# EAGLE design sensor circuit (EAGLE 8.4.0)
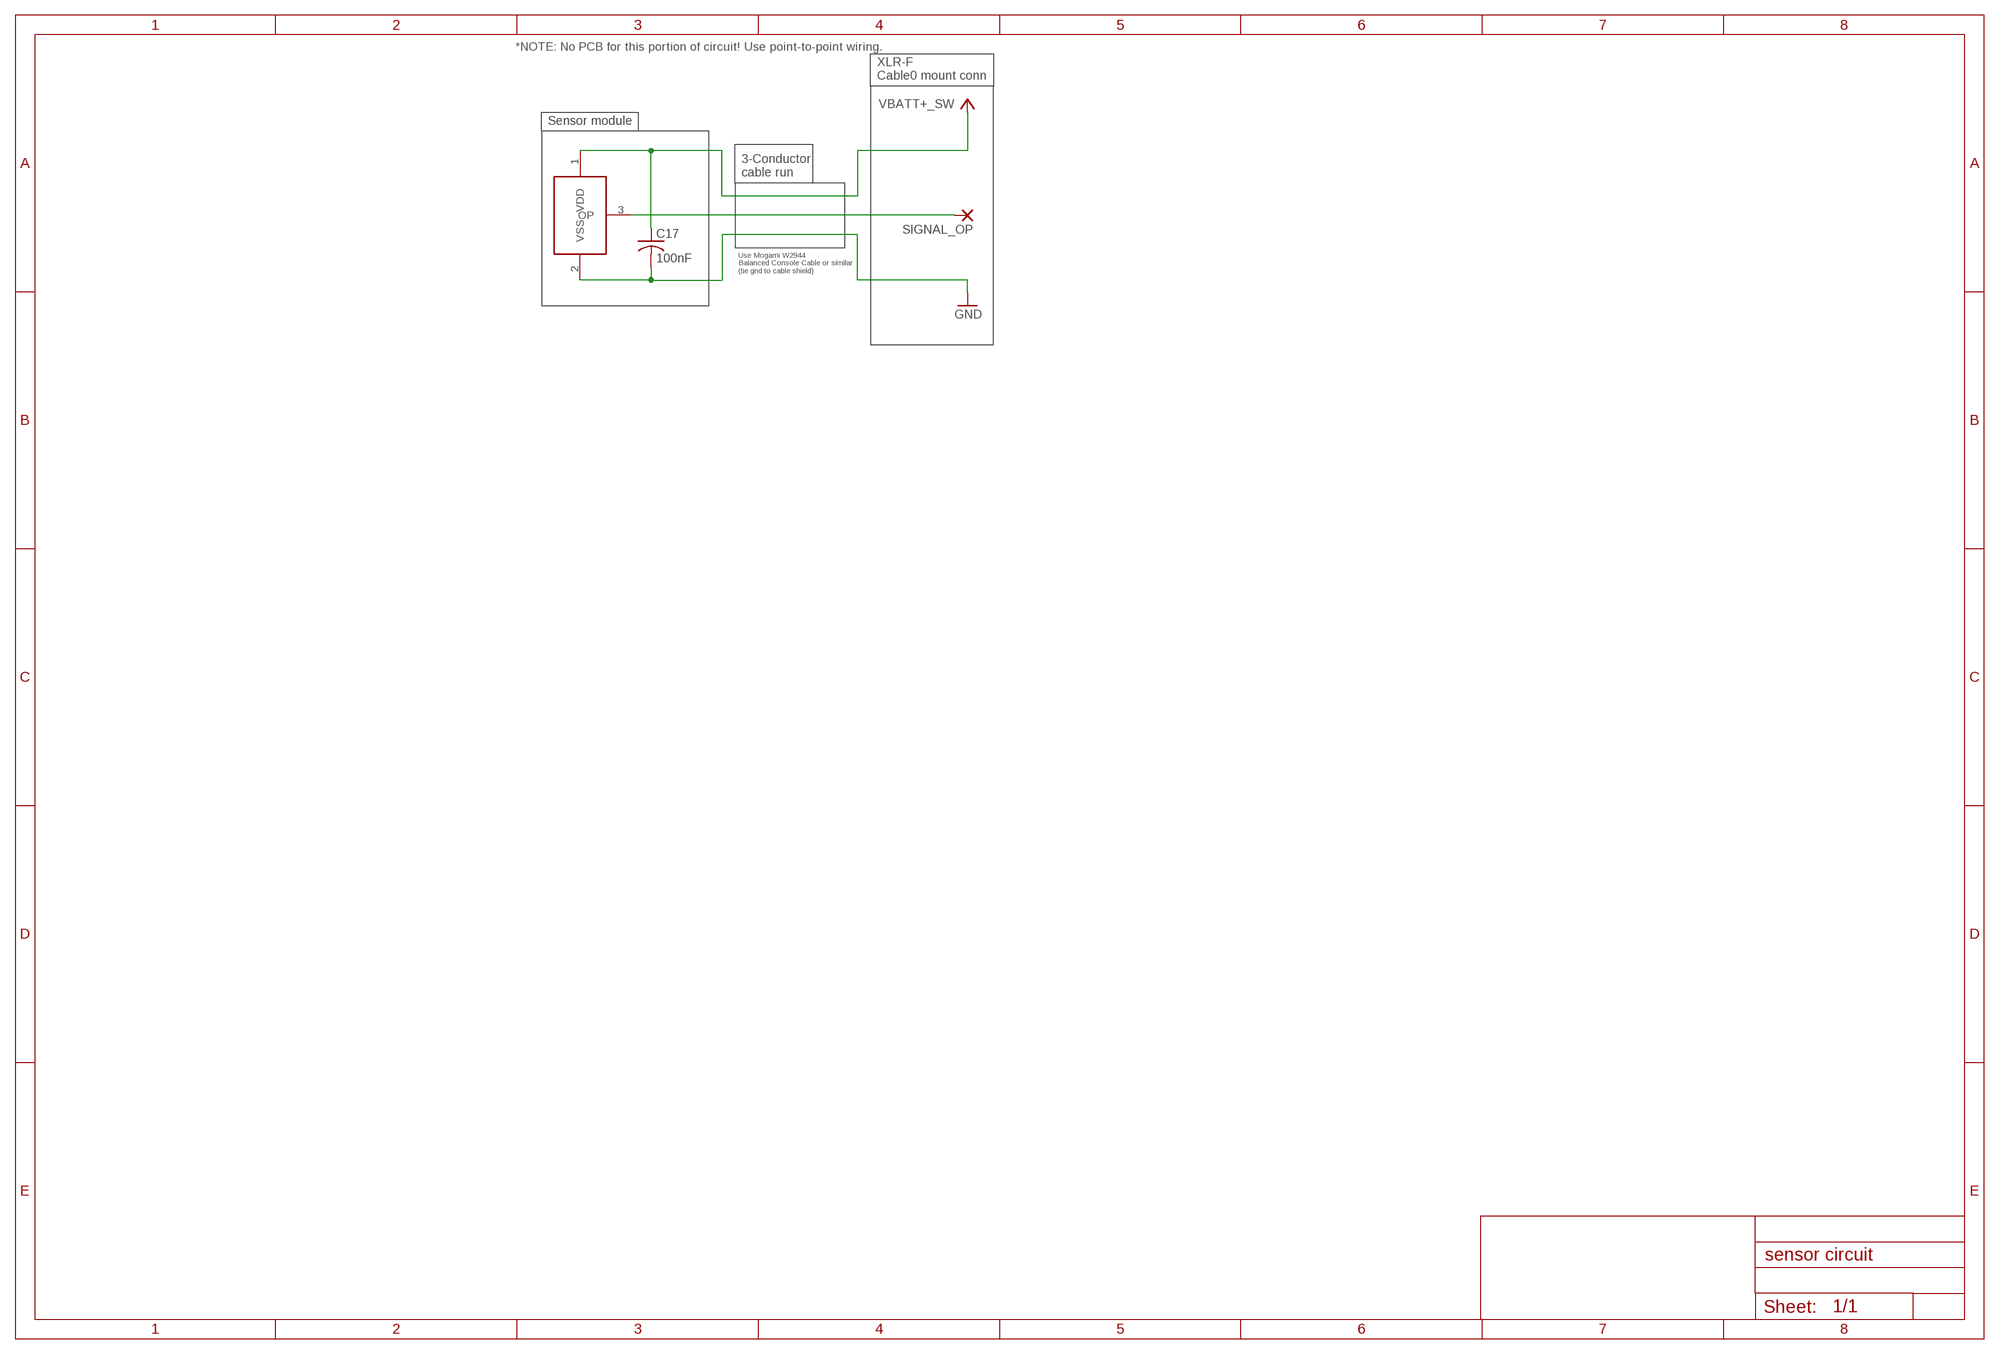
[diagram p0: schematic, sheet 1]

## Parts
C17  100nF  C-US025-024X044  [C025-024X044]
SIGNAL_OP  1,6/0,8  [1,6/0,8]
U1A  US5881  [TO-92]

## Nets
GND: C17.2 U1A.2(VSS)
N$37: SIGNAL_OP.1(P) U1A.3(OP)
VBATT+_SW: C17.1 U1A.1(VDD)

## Notes on the sheet
- *NOTE: No PCB for this portion of circuit! Use point-to-point wiring.
- XLR-F
  Cable0 mount conn
- Sensor module
- 3-Conductor
  cable run
- Use Mogami W2944
  Balanced Console Cable or similar
  (tie gnd to cable shield)

## Library data of the parts
C17 = rcl:C-US: CAPACITOR, American symbol
SIGNAL_OP = wirepad:1,6/0,8: THROUGH-HOLE PAD
U1A = US5881:US5881: Hall effect sensor in TO-92 package

## Board
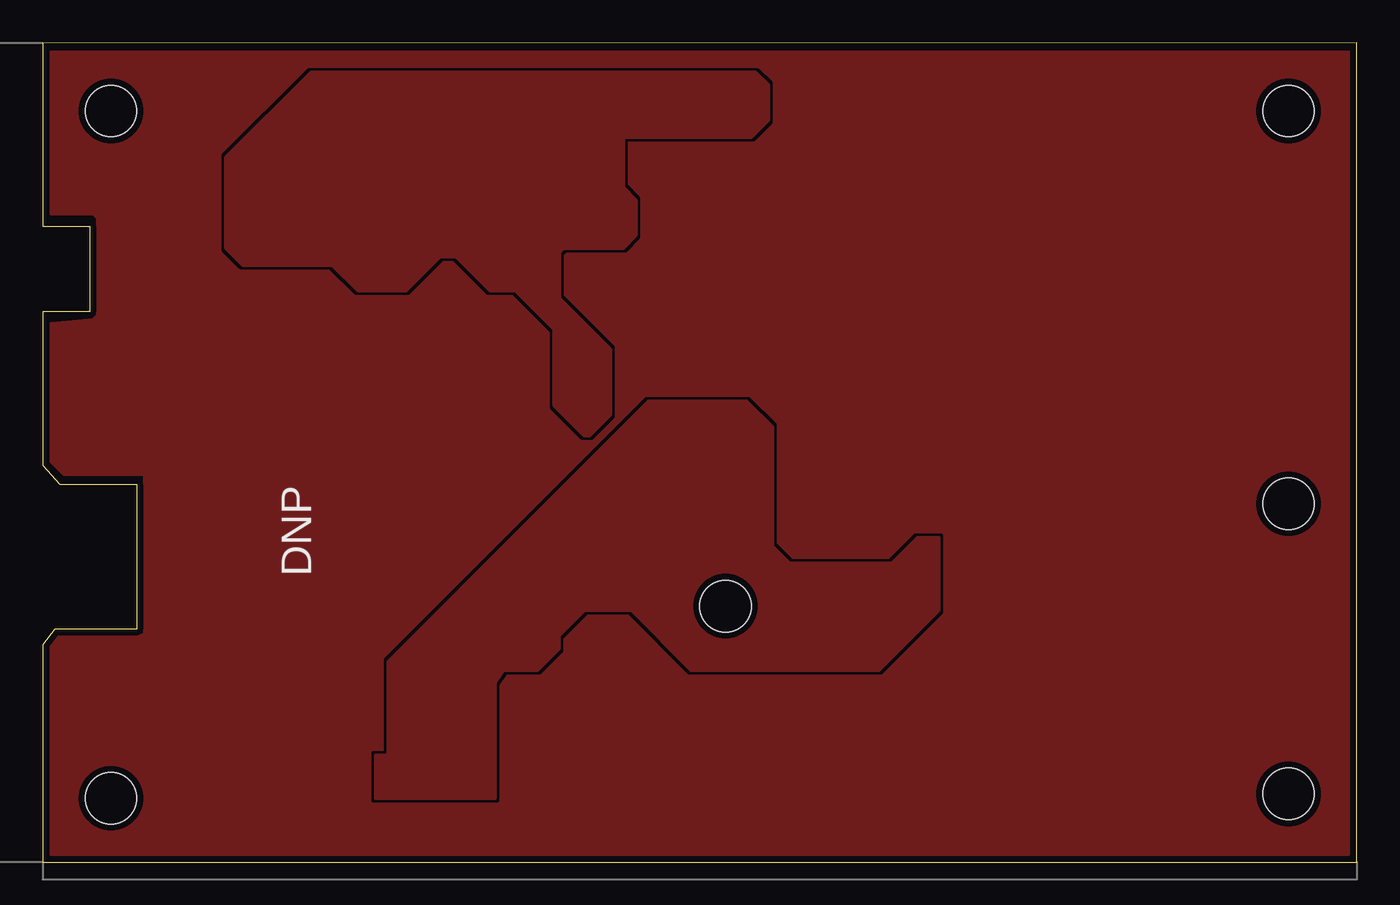
[diagram p1: board, top side]
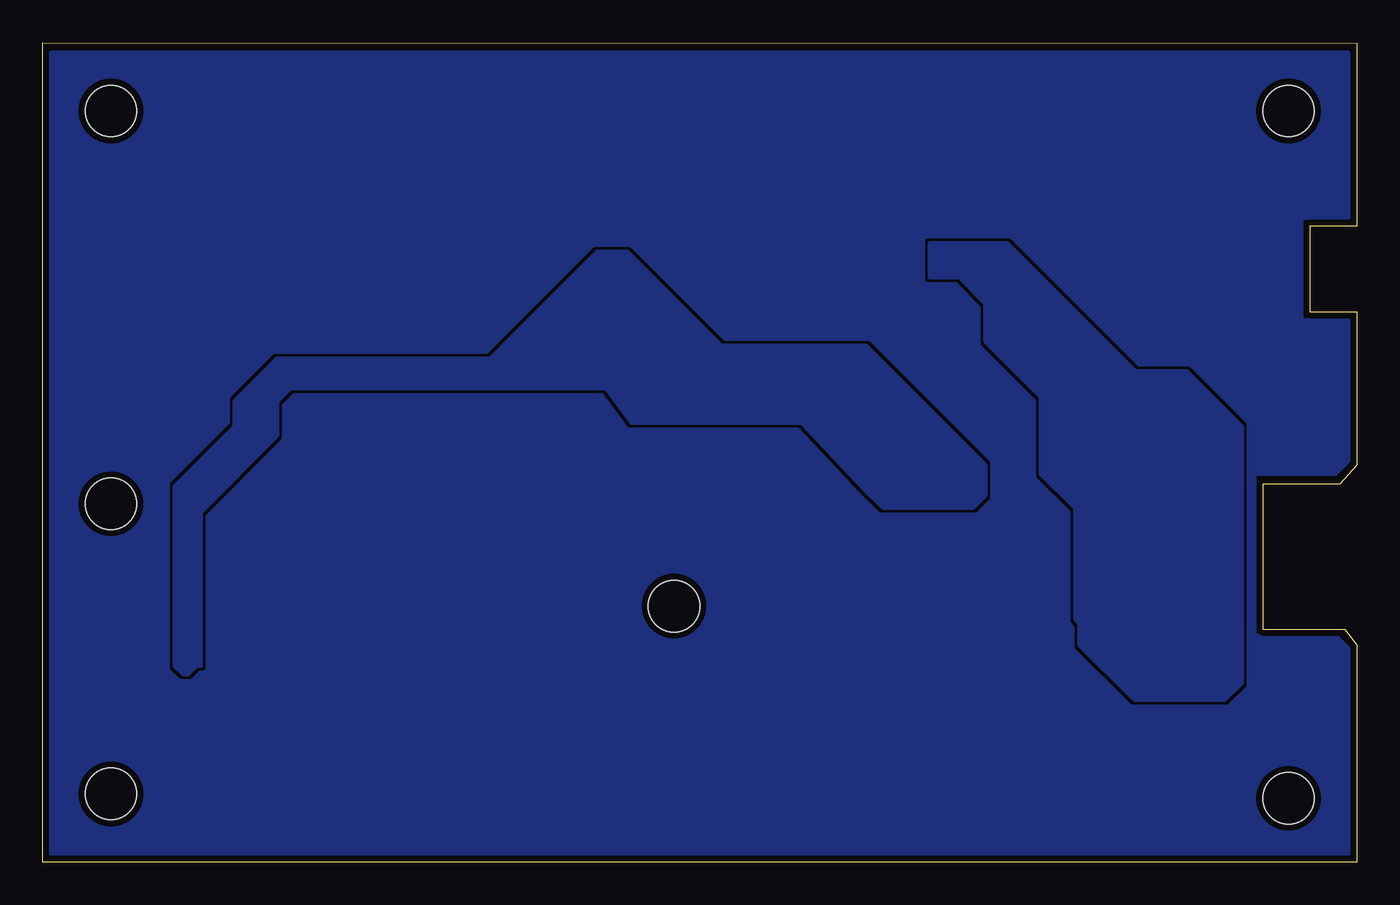
[diagram p2: board, bottom side, seen from below]

Size 77 x 48 mm. Coordinates in mm from the lower left corner, seen from the top.
Outline: 0,0 77,0 77,48 0,47.97 0,37.25 2.75,37.25 2.75,32.25 0,32.25 0,23.25 1,22.15 5.5,22.15 5.5,13.65 0.7,13.65 0,12.75 0,0
Copper layers (1*16): Top 0.0356mm / dielectric 1.5011mm / Bottom 0.0356mm
Design rules "LaenPCBOrder *": minimum track width 6mil, minimum drill 13mil, track to track 6mil, track to pad 6mil, pad to pad 6mil, via to via 6mil, smd to smd 6mil, copper to edge 15mil, drill to drill 6mil, minimum pad ring 7mil, minimum via ring 7mil, stop-mask expansion 3mil, vias tented up to drill 0mil, thermal gap 10mil
Holes 3 mm at 4,3.75 4,44 73,44 73,21 73,4 40,15

### Footprints (pad centres in the part's own frame; a part is rotated, then mirrored left to right if it is on the bottom)
C025-024X044 = drill 0.813 octagon: 1 -1.27,0; 2 1.27,0
1,6/0,8 = drill 0.813 pad 1.6 octagon: 1 0,0
TO-92 = drill 0.813 pad 1.88: 1 -1.27,0; 2 0,1.905; 3 1.27,0

### Placement (x,y rotation side)
C17  117.24,29.34 0 top  (outside the outline)
SIGNAL_OP  123.14,23.37 0 top  (outside the outline)
U1A  123.11,29.16 270 top  (outside the outline)

### Tracks (layer width: path | path; a pad name or v marks a point on that pad's centre or on a via)
+3V3
  pour Top: 35.5,27 20.25,11.75 20.25,6.25 19.5,6.25 19.5,3.75 26.5,3.75 26.5,10.5 27,11.25 29,11.25 30.25,12.5 30.25,13.25 31.75,14.75 34.5,14.75 38,11.25 49,11.25 52.5,14.75 52.5,19 51.25,19 49.75,17.5 43.75,17.5 42.75,18.5 42.75,25.5 41.25,27
+V+_CHG
  pour Bottom: 16.25,14 16.25,12.75 13,9.5 7.75,9.5 6.75,10.5 6.75,25.5 10,28.75 13,28.75 20.5,36.25 25,36.25 25,34.25 23.25,34.25 21.75,32.75 21.75,30.5 18.5,27.25 18.5,22.75 16.5,20.75 16.5,14.25
GND  (1 unrouted)
  pour Bottom (rank 3): 0.5,0.5 0.5,12.5 1.25,13.25 6,13.25 6,22.75 1.25,22.75 0.5,23.5 0.5,31.75 3.25,31.75 3.25,37.75 0.5,37.75 0.5,47.4 76.5,47.4 76.5,0.5
  pour Top (rank 2): 0.5,23.5 0.5,31.5 3,31.75 3.25,32 3.25,37.75 3,38 0.5,38 0.5,47.4 76.5,47.45 76.5,0.5 0.5,0.5 0.5,13 0.75,13.25 6,13.25 6,22.75 1.25,22.75
N$37  (1 unrouted)
VBATT+
  pour Top: 10.75,36 11.75,35 17,35 18.5,33.5 21.25,33.5 23.25,35.5 24.25,35.5 26.25,33.5 27.75,33.5 30,31.25 30,26.75 31.75,25 32,25 33.25,26.25 33.25,30 30.25,33 30.25,35.75 30.5,36 34,36 34.75,36.75 34.75,38.75 34,39.5 34,42.5 41.5,42.5 42.5,43.5 42.5,45.5 41.75,46.25 15.75,46.25 10.75,41.25
VBATT+_SW  (1 unrouted)
  pour Bottom: 28.75,30.25 37.25,30.25 42.75,35.75 44.5,35.75 50.75,29.5 63.25,29.5 65.75,27 65.75,25.5 69.25,22 69.25,11.5 68.75,11 68.5,11 68,11.5 67.75,11.5 67.75,20.5 63.25,25 63.25,27 62.5,27.75 44,27.75 42.5,25.75 32.5,25.75 28.75,21.75 27.75,20.75 22.5,20.75 21.75,21.5 21.75,23.25

### Text on the board
tPlace: DNP